# Altium schematic sheet rf_lpf_80.SchDoc: mcHF Pro Transceiver RF board
size A3; Author: Krassi Atanassov; CompanyName: MØNKA; Engineer: For radio amateurs experimentation, non-commercial use only. Thank you!; Revision: 0.8.2; SheetTotal: 14
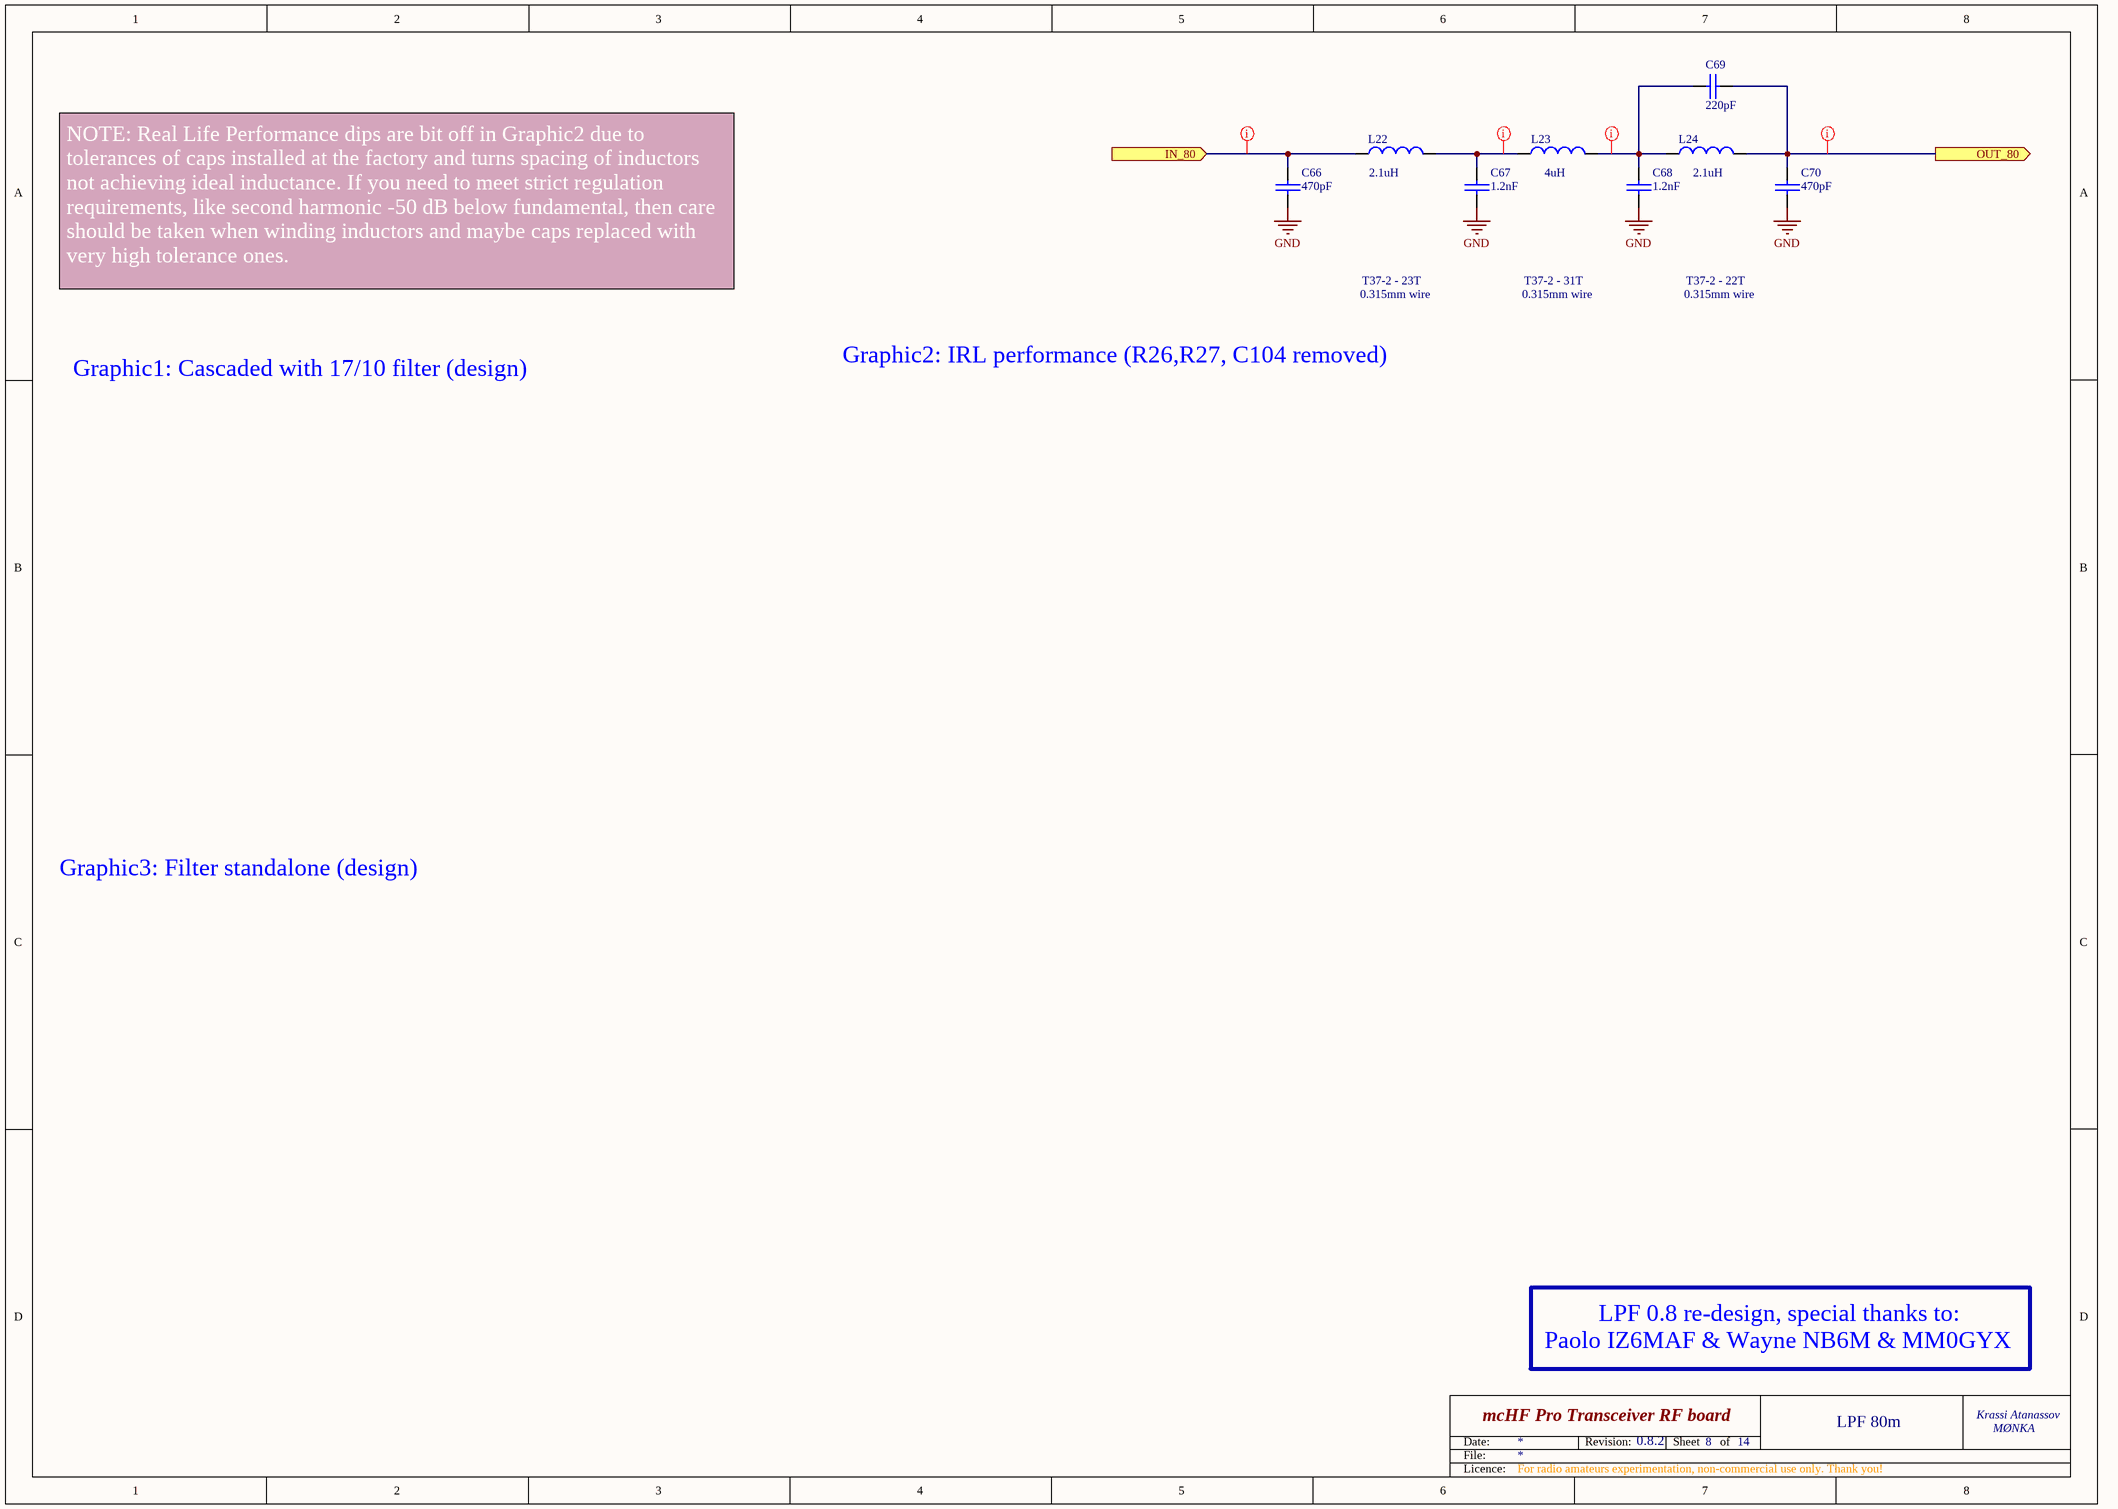
[diagram p0: rf_lpf_80.SchDoc]

## Parts
C66  470pF  [0805]
C67  1.2nF  [0805]
C68  1.2nF  [0805]
C69  220pF  [0805]
C70  470pF  [0805]
L22  Inductance: 2.1uH  [LPF_IND]  (hidden comment: T37-2)
L23  Inductance: 4uH  [LPF_IND]  (hidden comment: T37-2)
L24  Inductance: 2.1uH  [LPF_IND]  (hidden comment: T37-2)

## Ports
IN_80 (in), OUT_80 (out)

## Nets
GND: C66.2 C67.2 C68.2 C70.2
IN_80: C66.1 L22.1 ; port IN_80
OUT_80: C69.1 C70.1 L24.2 ; port OUT_80
NetC67_1: C67.1 L22.2 L23.1
NetC68_1: C68.1 C69.2 L23.2 L24.1

## Layout directives
rule Width Constraint [Pref Width = 30mil    Min Width = 30mil    Max Width = 30mil]: IN_80, NetC67_1, NetC68_1, OUT_80

## Notes on the sheet
- NOTE: Real Life Performance dips are bit off in Graphic2 due to tolerances of caps installed at the factory and turns spacing of inductors not achieving ideal inductance. If you need to meet strict regulation requirements, like second harmonic -50 dB below fundamental, then care should be taken when winding inductors and maybe caps replaced with very high tolerance ones.
- T37-2 - 23T
- 0.315mm wire
- T37-2 - 31T
- T37-2 - 22T
- Graphic1: Cascaded with 17/10 filter (design)
- Graphic2: IRL performance (R26,R27, C104 removed)
- Graphic3: Filter standalone (design)
- LPF 0.8 re-design, special thanks to:
- Paolo IZ6MAF & Wayne NB6M & MM0GYX
- 8
- LPF 80m
- Date:
- File:
- Revision:
- Sheet
- of
- Licence:

## Library data of the parts
C66 C70 = CAP: Capacitor; QT Order: QCC-00460; Notes: COG/NPO; Voltage: 100V; Price: 0.063
C67 C68 = CAP: Capacitor; QT Order: QCC-00142; Notes: COG/NPO; Voltage: 100V; Price: 0.143
C69 = CAP: Capacitor; Notes: COG/NPO; Voltage: 100V; Price: 0.068
L22-L24 = LPF_IND: T37-2 handwound inductor; Notes: post assembly; Price: 0.20